# Altium schematic sheet 3_USB-SATA.SchDoc
size A2
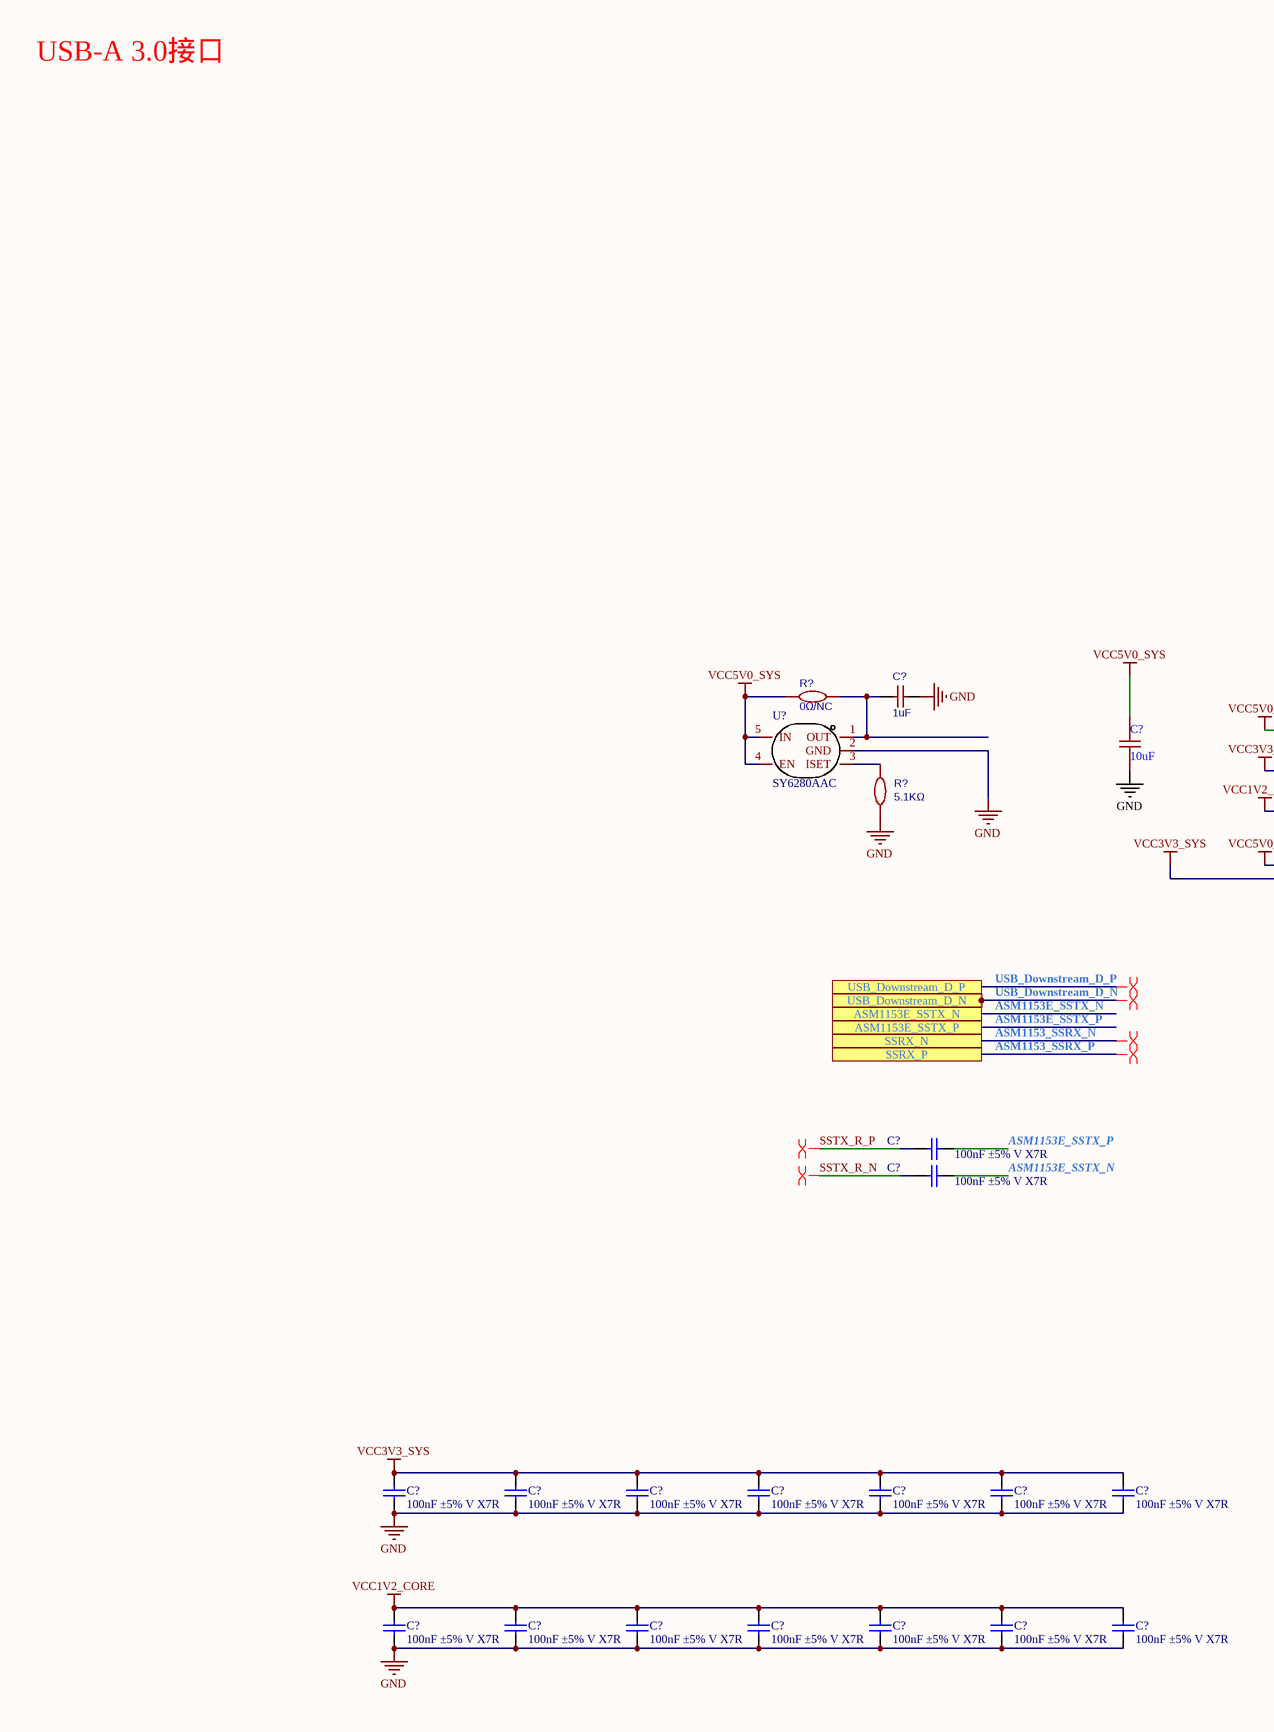
[diagram p0: 3_USB-SATA.SchDoc, left]
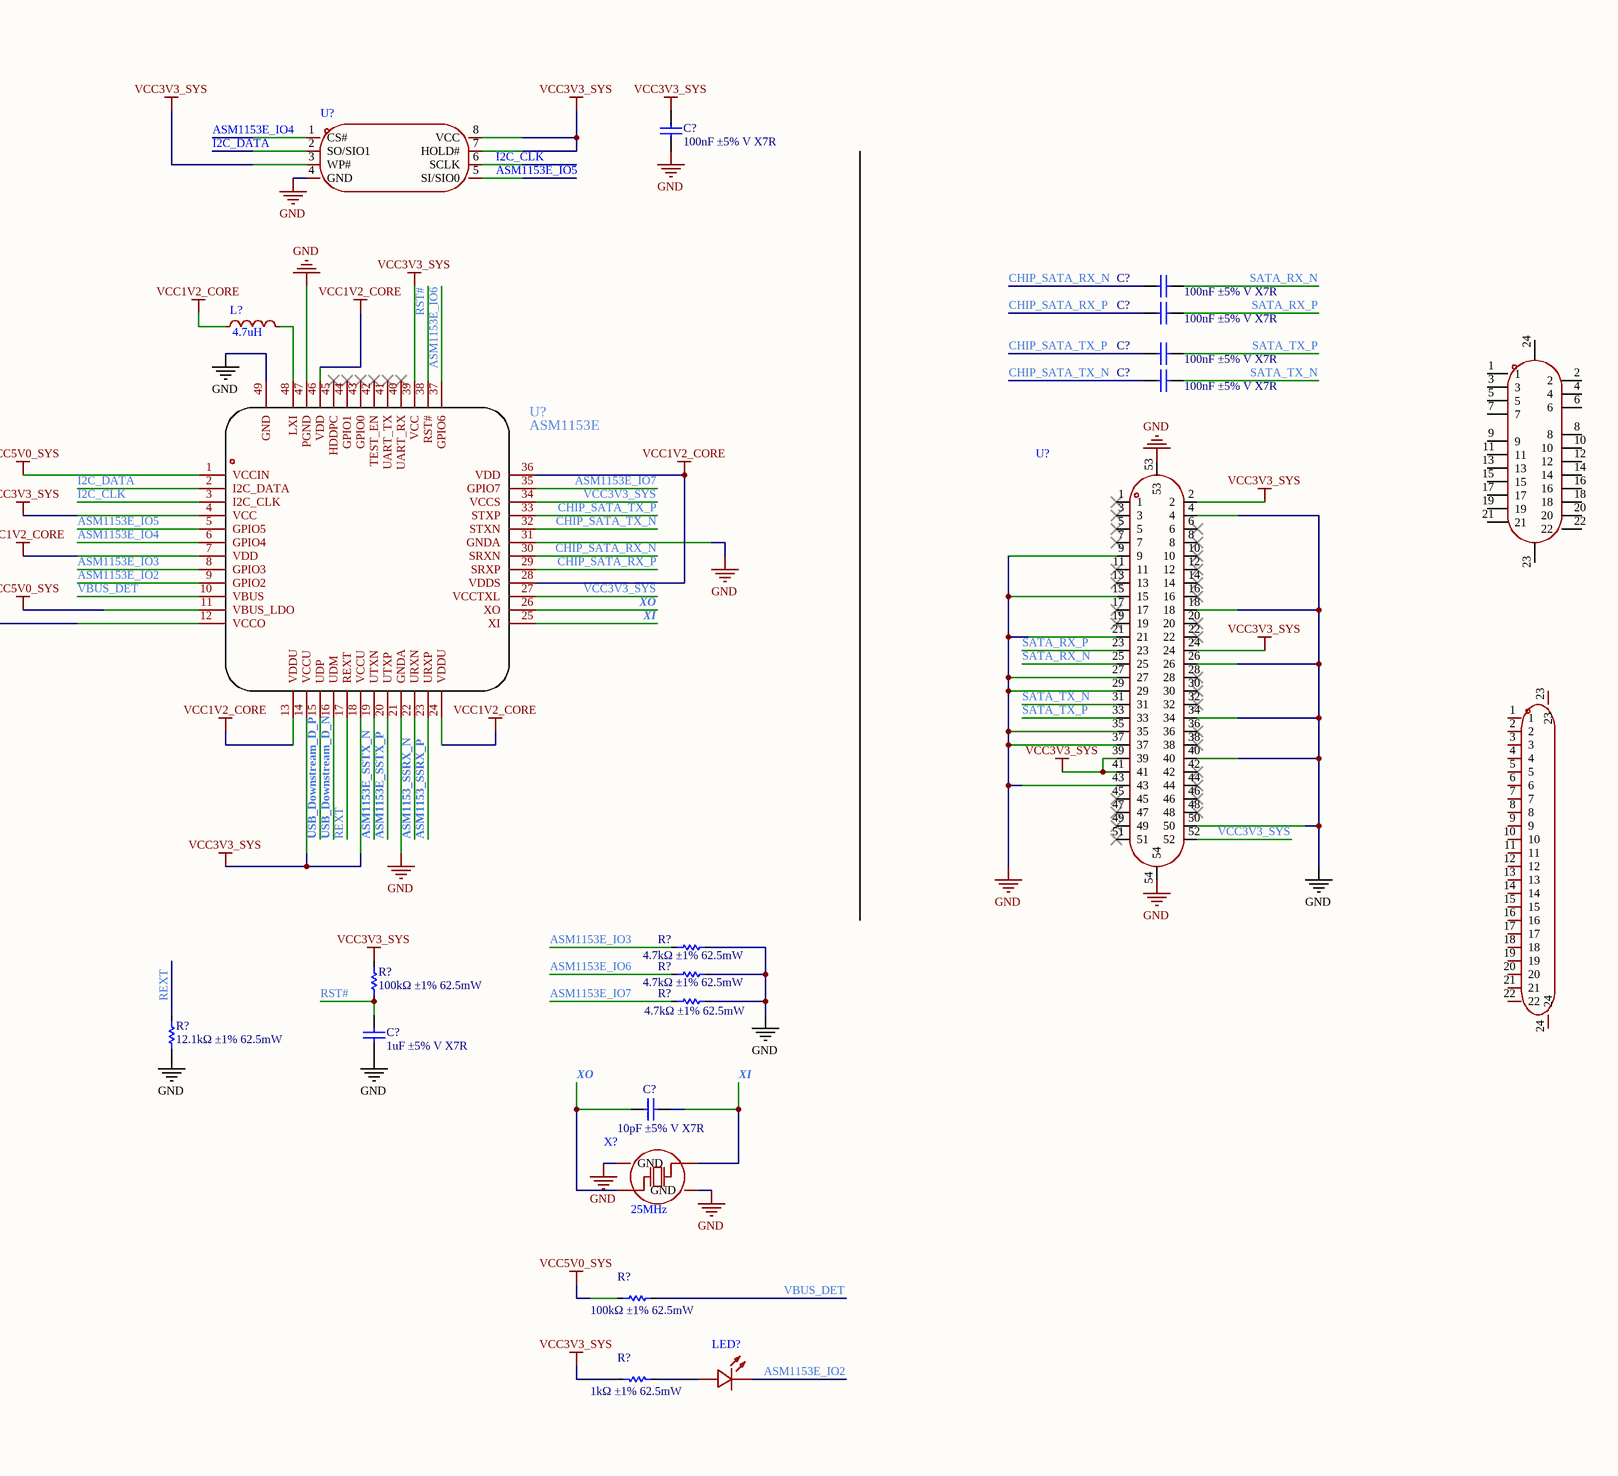
[diagram p1: 3_USB-SATA.SchDoc, right]

## Parts
(Parts that share a designator on the sheet are numbered #1, #2 ... from top to bottom, then left to right.)
C?#1  100nF ±5% V X7R  [C0402]
C?#2  100nF ±5% V X7R  [C0402]
C?#3  100nF ±5% V X7R  [C0402]
C?#4  100nF ±5% V X7R  [C0402]
C?#5  100nF ±5% V X7R  [C0402]
C?#6  1uF  [C0603]
C?#7  10uF  [C0603]
C?#8  100nF ±5% V X7R  [C0402]
C?#9  100nF ±5% V X7R  [C0402]
C?#10  1uF ±5% V X7R  [C0402]
C?#11  10pF ±5% V X7R  [C0402]
C?#12  100nF ±5% V X7R  [C0402]
C?#13  100nF ±5% V X7R  [C0402]
C?#14  100nF ±5% V X7R  [C0402]
C?#15  100nF ±5% V X7R  [C0402]
C?#16  100nF ±5% V X7R  [C0402]
C?#17  100nF ±5% V X7R  [C0402]
C?#18  100nF ±5% V X7R  [C0402]
C?#19  100nF ±5% V X7R  [C0402]
C?#20  100nF ±5% V X7R  [C0402]
C?#21  100nF ±5% V X7R  [C0402]
C?#22  100nF ±5% V X7R  [C0402]
C?#23  100nF ±5% V X7R  [C0402]
C?#24  100nF ±5% V X7R  [C0402]
C?#25  100nF ±5% V X7R  [C0402]
J?#1  HDGCYLSY-SATA-113  [CONN-TH_HDGCYLSY-SATA-113]  (value not drawn)
J?#2  XUTS-2218-0127  [CONN-SMD_SATA7-15-LT]  (value not drawn)
L?  4.7uH  [IND-SMD_L3.0-W3.0-1]
LED?  VLMW1500-GS08  [LED0402-R-RD_WHITE]  (value not drawn)
R?#1  0Ω/NC  [R0603]
R?#2  5.1KΩ  [R0603]
R?#3  4.7kΩ ±1% 62.5mW  [R0402]
R?#4  4.7kΩ ±1% 62.5mW  [R0402]
R?#5  100kΩ ±1% 62.5mW  [R0402]
R?#6  4.7kΩ ±1% 62.5mW  [R0402]
R?#7  12.1kΩ ±1% 62.5mW  [R0402]
R?#8  100kΩ ±1% 62.5mW  [R0402]
R?#9  1kΩ ±1% 62.5mW  [R0402]
U?#1  MX25L512EMI-10G  [SOP-8_L5.0-W4.0-P1.27-LS6.0-BL]  (value not drawn)
U?#2  SY6280AAC  [SOT-23-5_L3.0-W1.7-P0.95-LS2.8-BR]
U?#3  PCIE-52P70H  [PCIE-SMD_52P-P0.80_PCIE-52PXXH]  (value not drawn)
U?#4  ASM1153E  [QFN-48_L6.0-W6.0-P0.40-BL-EP4.2]
X?  25MHz  [CRYSTAL-SMD_4P-L3.2-W2.5-BL]

## Ports
ASM1153E_SSTX_N, ASM1153E_SSTX_P, SSRX_N, SSRX_P, USB_Downstream_D_N, USB_Downstream_D_P

## Nets
GND: C?#1.1 C?#6.1 C?#7.1 C?#10.1 C?#12.1 C?#13.1 C?#14.1 C?#15.1 C?#16.1 C?#17.1 C?#18.1 C?#19.1 C?#20.1 C?#21.1 C?#22.1 C?#23.1 C?#24.1 C?#25.1 R?#2.2 R?#3.1 R?#4.1 R?#6.1 R?#7.1 U?#1.4(GND) U?#2.2(GND) U?#3.4 U?#3.9 U?#3.15 U?#3.18 U?#3.21 U?#3.26 U?#3.27 U?#3.29 U?#3.34 U?#3.35 U?#3.37 U?#3.40 U?#3.43 U?#3.50 U?#3.53 U?#3.54 U?#4.21(GNDA) U?#4.31(GNDA) U?#4.47(PGND) U?#4.49(GND) X?.2(GND) X?.4(GND)
VCC1V2_CORE: C?#19.2 C?#20.2 C?#21.2 C?#22.2 C?#23.2 C?#24.2 C?#25.2 L?.1 U?#4.7(VDD) U?#4.13(VDDU) U?#4.24(VDDU) U?#4.28(VDDS) U?#4.36(VDD) U?#4.46(VDD)
VCC3V3_SYS: C?#1.2 C?#12.2 C?#13.2 C?#14.2 C?#15.2 C?#16.2 C?#17.2 C?#18.2 R?#5.2 R?#9.1 U?#1.3(WP#) U?#1.7(HOLD#) U?#1.8(VCC) U?#3.2 U?#3.24 U?#3.39 U?#3.41 U?#3.52 U?#4.4(VCC) U?#4.12(VCCO) U?#4.14(VCCU) U?#4.18(VCCU) U?#4.27(VCCTXL) U?#4.34(VCCS) U?#4.39(VCC)
VCC5V0_SYS: C?#7.2 R?#1.1 R?#8.2 U?#2.4(EN) U?#2.5(IN) U?#4.1(VCCIN) U?#4.11(VBUS_LDO)
ASM1153_SSRX_N: U?#4.22(URXN) ; port SSRX_N
ASM1153_SSRX_P: U?#4.23(URXP) ; port SSRX_P
ASM1153E_IO2: LED?.2(K) U?#4.9(GPIO2)
ASM1153E_IO3: R?#3.2 U?#4.8(GPIO3)
ASM1153E_IO4: U?#1.1(CS#) U?#4.6(GPIO4)
ASM1153E_IO5: U?#1.5(SI/SIO0) U?#4.5(GPIO5)
ASM1153E_IO6: R?#4.2 U?#4.37(GPIO6)
ASM1153E_IO7: R?#6.2 U?#4.35(GPIO7)
ASM1153E_SSTX_N: C?#9.1 U?#4.19(UTXN) ; port ASM1153E_SSTX_N
ASM1153E_SSTX_P: C?#8.1 U?#4.20(UTXP) ; port ASM1153E_SSTX_P
CHIP_SATA_RX_N: C?#2.2 U?#4.30(SRXN)
CHIP_SATA_RX_P: C?#3.2 U?#4.29(SRXP)
CHIP_SATA_TX_N: C?#5.2 U?#4.32(STXN)
CHIP_SATA_TX_P: C?#4.2 U?#4.33(STXP)
I2C_CLK: U?#1.6(SCLK) U?#4.3(I2C_CLK)
I2C_DATA: U?#1.2(SO/SIO1) U?#4.2(I2C_DATA)
REXT: R?#7.2 U?#4.17(REXT)
RST#: C?#10.2 R?#5.1 U?#4.38(RST#)
SATA_RX_N: C?#2.1 U?#3.25
SATA_RX_P: C?#3.1 U?#3.23
SATA_TX_N: C?#5.1 U?#3.31
SATA_TX_P: C?#4.1 U?#3.33
SSTX_R_N: C?#9.2
SSTX_R_P: C?#8.2
USB_Downstream_D_N: U?#4.16(UDM) ; port USB_Downstream_D_N
USB_Downstream_D_P: U?#4.15(UDP) ; port USB_Downstream_D_P
VBUS_DET: R?#8.1 U?#4.10(VBUS)
XI: C?#11.1 U?#4.25(XI) X?.3(OSC2)
XO: C?#11.2 U?#4.26(XO) X?.1(OSC1)
NetC?#6_2: C?#6.2 R?#1.2 U?#2.1(OUT)
NetL?_2: L?.2 U?#4.48(LXI)
NetLED?_1: LED?.1(A) R?#9.2
NetR?#2_1: R?#2.1 U?#2.3(ISET)

Not connected (* = marked no-connect by the designer): J?#1 1 2 3 4 5 6 7 8 9 10 11 12 13 14 15 16 17 18 19 20 21 22 23 24; J?#2 1 2 3 4 5 6 7 8 9 10 11 12 13 14 15 16 17 18 19 20 21 22 23 24; U?#3 1* 3* 5* 6* 7* 8* 10* 11* 12* 13* 14* 16* 17* 19* 20* 22* 28* 30* 32* 36* 38* 42* 44* 45* 46* 47* 48* 49* 51*; U?#4 40(UART_RX)* 41(UART_TX)* 42(TEST_EN)* 43(GPIO0)* 44(GPIO1)* 45(HDDPC)*

## Layout directives
differential pair: ASM1153_SSRX_N, ASM1153_SSRX_P, SSTX_R_N, SSTX_R_P, USB_Downstream_D_N, USB_Downstream_D_P

## Notes on the sheet
- USB-A 3.0接口

## Library data of the parts
C?#1-C?#5 C?#8-C?#25 = C0402: Capacitor; Published: 8-Jun-2000; LatestRevisionDate: 17-Jul-2002; LatestRevisionNote: Re-released for DXP Platform.; PackageReference: RAD-0.3; Publisher: Altium Limited; PackageDescription: Radial Cap, Thru-Hole; 2 Leads; 0.3 in Pin Spacing
C?#6 = C: BOM_Manufacturer: FH; BOM_Manufacturer Part: 0603F104M500NT; nameAlias: Capacitance; BOM_Supplier: LCSC; BOM_Supplier Part: C42998; BOM_JLCPCB Part Class: Extended Part; spicePre: C; spiceSymbolName: 0603F104M500NT
C?#7 = CL10A106KP8NNNC: Manufacturer: SAMSUNG(三星); Add into BOM: yes; Tolerance: ±10%; Voltage Rated: 10V; Temperature Coefficient: X5R; Symbol: CL10A106KP8NNNC; Device: CL10A106KP8NNNC; LCSC Part Name: 10uF ±10% 10V; Supplier Part: C19702; Manufacturer Part: CL10A106KP8NNNC; Supplier Footprint: 0603; JLCPCB Part Class: Basic Part; Datasheet: https://atta.szlcsc.com/upload/public/pdf/source/20160103/1457707703378.pdf; Supplier: LCSC; Convert to PCB: yes; Value: 10uF
J?#1 = SATA-22P: Manufacturer: HDGC(华德共创); Add into BOM: yes; Interface Form: SATA; Connector Type: 母; Supplementary Features: 鱼叉脚(金属); Symbol: HDGCYLSY-SATA-113; Device: HDGCYLSY-SATA-113; LCSC Part Name: HDGCYLSY-SATA-113; Supplier Part: C22438715; Manufacturer Part: HDGCYLSY-SATA-113; Supplier Footprint: 插件; JLCPCB Part Class: Extended Part; Datasheet: https://atta.szlcsc.com/upload/public/pdf/source/20240523/CC8F1A74D84556CFB703F6AD7368385F.pdf; Supplier: LCSC; Convert to PCB: yes; Number of Pins: 22P; Mounting Style: 直插; Body Height: -; Operating Temperature Range: -
J?#2 = SATA-22P_1: Manufacturer: LX(连欣科技); Add into BOM: yes; Symbol: XUTS-2218-0127; Device: XUTS-2218-0127; LCSC Part Name: XUTS-2218-0127; Supplier Part: C19193804; Manufacturer Part: XUTS-2218-0127; Supplier Footprint: SMD,P=1.27mm; JLCPCB Part Class: Extended Part; Datasheet: https://atta.szlcsc.com/upload/public/pdf/source/20231117/B34EFEA7383D9ABF34D19E7DB42C8BB5.pdf; Supplier: LCSC; Convert to PCB: yes
L? = CKCS3012-4.7uH/M: Manufacturer: CENKER(岑科); Add into BOM: yes; Tolerance: ±20%; Rated Current: 1.24A; DC Resistance (DCR): 120mΩ; Symbol: CKCS3012-4.7UH/M; Device: CKCS3012-4.7uH/M; LCSC Part Name: 4.7uH ±20% 1.24A 120mΩ; Supplier Part: C354557; Manufacturer Part: CKCS3012-4.7uH/M; Supplier Footprint: SMD; JLCPCB Part Class: Extended Part; Datasheet: https://atta.szlcsc.com/upload/public/pdf/source/20190115/C354557_61A3705615E4FADB9C94D2137EE09B6B.pdf; Supplier: LCSC; Convert to PCB: yes; Value: 4.7uH
LED? = VLMW1500-GS08: Manufacturer: VISHAY(威世); Add into BOM: yes; Emitted Color: 白灯; Forward Current: 5mA; Forward Voltage (VF): 2.9V; Luminous Intensity: 90mcd; Power Dissipation: 70mW; Symbol: VLMW1500-GS08; Device: VLMW1500-GS08; LCSC Part Name: 白灯; Supplier Part: C511379; Manufacturer Part: VLMW1500-GS08; Supplier Footprint: 0402; JLCPCB Part Class: Extended Part; Datasheet: https://atta.szlcsc.com/upload/public/pdf/source/20200408/C511379_C2F59698F604A60E2C48FD851172BBA0.pdf; Supplier: LCSC; Convert to PCB: yes; Diode Configuration: -; Lens Color: -; Dominant Wavelength: -; Peak Wavelength: -; Color Temperature: -; Luminous Flux (@25℃): -; Viewing Angle: -; Mounting Sytle: -; Operating Temperature: -30~+80
R?#1 R?#2 = R: BOM_Manufacturer: Guangdong Fenghua Advanced Tech; BOM_Manufacturer Part: RS-03K1002FT; Resistance (Ohms): 10K; nameAlias: Resistance; Contributor: LCSC; BOM_Supplier: LCSC; BOM_Supplier Part: C115324; spicePre: R; spiceSymbolName: RS-03K1002FT
R?#3-R?#9 = R0402: Resistor; Published: 8-Jun-2000; LatestRevisionDate: 17-Jul-2002; LatestRevisionNote: Re-released for DXP Platform.; PackageReference: AXIAL-0.3; Publisher: Altium Limited; PackageDescription: Axial Device, Thru-Hole; 2 Leads; 0.3 in Pin Spacing
U?#1 = MX25L512EMI-10G: Manufacturer: MXIC(旺宏电子); Symbol: MX25L512EMI-10G_C2803023; Add into BOM: yes; Device: MX25L512EMI-10G; LCSC Part Name: MX25L512EMI-10G; Supplier Part: C2803023; Manufacturer Part: MX25L512EMI-10G; Supplier Footprint: SOP-8; JLCPCB Part Class: Extended Part; Datasheet: https://atta.szlcsc.com/upload/public/pdf/source/20210906/B454D1B9C39ED3C00F3164A690CF7DD8.pdf; Supplier: LCSC; Convert to PCB: yes
U?#3 = PCIE-52P70H: Manufacturer: XUNPU(讯普); Symbol: PCIE-52P70H_C2982554; Add into BOM: yes; Device: PCIE-52P70H; LCSC Part Name: PCIE-52P70H; Supplier Part: C2982554; Manufacturer Part: PCIE-52P70H; Supplier Footprint: SMD; JLCPCB Part Class: Extended Part; Datasheet: https://atta.szlcsc.com/upload/public/pdf/source/20220311/DC8B167F9A8E29C645B8AA97E9059897.pdf; Supplier: LCSC; Convert to PCB: yes
U?#4 = ASM1153E: USB3.0 to SATA Bridge Controller; Add into BOM: yes; Symbol: ASM1153E; Device: ASM1153E; LCSC Part Name: ASM1153E; Supplier Part: C2762919; Manufacturer Part: ASM1153E; Supplier Footprint: LQFN-48_EP_6.0x6.0x0.4P; JLCPCB Part Class: Extended Part; Datasheet: 2021-03-22/601605W/2276bd4a79cf4165b237c0c17b58d9ef/ASM1153Datasheetv1_1.pdf; Supplier: LCSC; Convert to PCB: yes
X? = X1E0000210621: Manufacturer: EPSON(爱普生); Add into BOM: yes; Crystal Type: 贴片无源晶振; Frequency Tolerance: ±10ppm; Load Capacitance: 9pF; Equivalent Series Resistance (ESR): 40Ω; Symbol: X1E0000210621; Device: X1E0000210621; LCSC Part Name: 25MHz ±10ppm 9pF; Supplier Part: C255920; Manufacturer Part: X1E0000210621; Supplier Footprint: SMD3225-4P; JLCPCB Part Class: Extended Part; Datasheet: https://atta.szlcsc.com/upload/public/pdf/source/20180822/C255920_F9528E19433D1B377CB88CCBF483E490.pdf; Supplier: LCSC; Convert to PCB: yes; Value: 25MHz; Frequency Stability: -; Operating Temperature: -40~+85